# EAGLE design untitled (EAGLE 7.4.0)
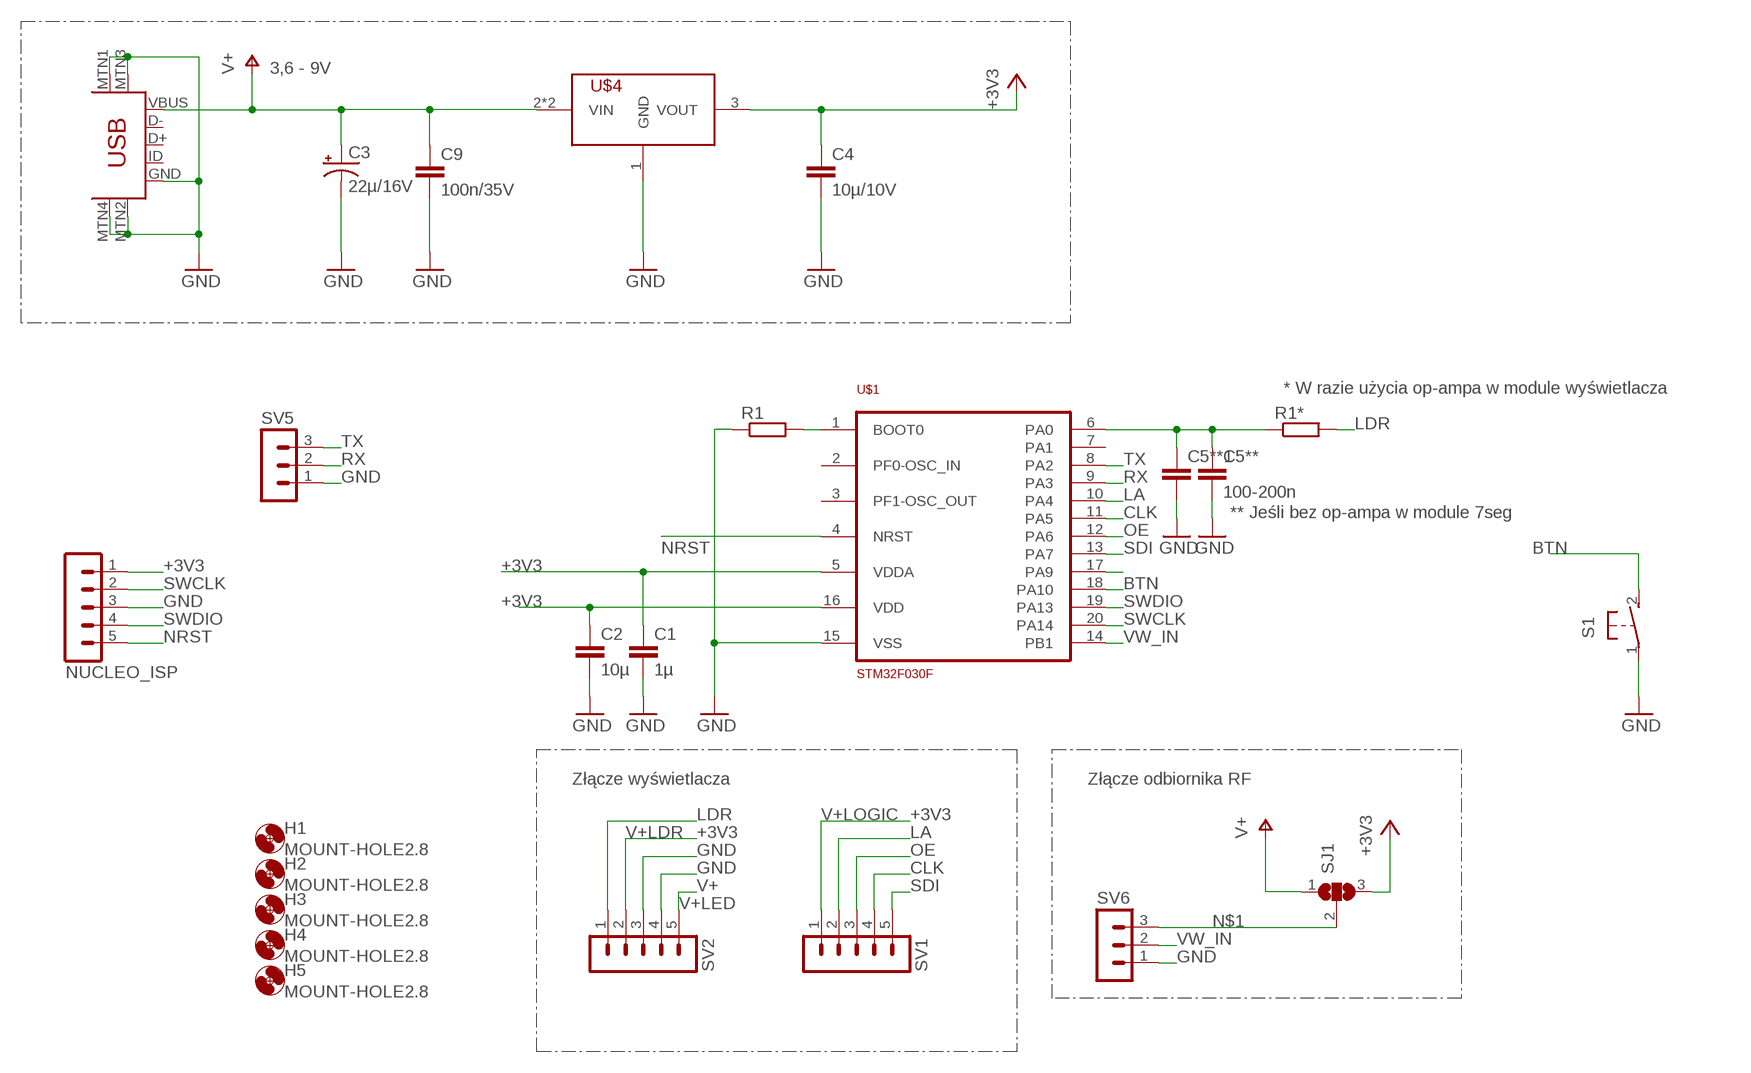
[diagram p0: schematic, sheet 1]

## Parts
C1  1µ  C-EUC0603  [C0603]
C2  10µ  C-EUC0603  [C0603]
C3  22µ/16V  CPOL-USE2.5-6  [E2,5-6]
C4  10µ/10V  C-EUC0603  [C0603]
C5**  100-200n  C-EUC0603  [C0603]
C5**1  C-EUC0603  [C0603]
C9  100n/35V  C-EUC0805  [C0805]
H1  MOUNT-HOLE2.8  [2,8]
H2  MOUNT-HOLE2.8  [2,8]
H3  MOUNT-HOLE2.8  [2,8]
H4  MOUNT-HOLE2.8  [2,8]
H5  MOUNT-HOLE2.8  [2,8]
NUCLEO_ISP  MA05-1  [MA05-1]
R1  R-EU_R0603  [R0603]
R1*  R-EU_R0603  [R0603]
S1  31-XX  [B3F-31XX]
SJ1  SJ2W  [SJ_2]
SV1  MA05-1  [MA05-1]
SV2  MA05-1  [MA05-1]
SV5  MA03-1  [MA03-1]
SV6  MA03-1  [MA03-1]
U$1  STM32F030F  [TSSOP20]
U$2  USB-MINIB-5PIN  [USB-MINIB]
U$4  HT7333  [SOT89]

## Nets
+3V3: C1.1 C2.1 C4.1 NUCLEO_ISP.1 SJ1.3 SV1.1 SV2.2 U$1.5(VDDA) U$1.16(VDD) U$4.3(VOUT)
BTN: S1.2(S) U$1.18(PA10)
CLK: SV1.4 U$1.11(PA5)
GND: C1.2 C2.2 C3.- C4.2 C5**1.2 C5**.2 C9.2 NUCLEO_ISP.3 R1.1 S1.1(P) SV2.3 SV2.4 SV5.1 SV6.1 U$1.15(VSS) U$2.GND U$2.MTN1(MTN2) U$2.MTN2(MTN3) U$2.MTN3(MTN1) U$2.MTN4 U$4.1(GND)
LA: SV1.2 U$1.10(PA4)
LDR: R1*.2 SV2.1
N$1: SJ1.2 SV6.3
N$4: C5**1.1 C5**.1 R1*.1 U$1.6(PA0)
N$6: R1.2 U$1.1(BOOT0)
N$9: U$1.17(PA9)
NRST: NUCLEO_ISP.5 U$1.4(NRST)
OE: SV1.3 U$1.12(PA6)
RX: SV5.2 U$1.9(PA3)
SDI: SV1.5 U$1.13(PA7)
SWCLK: NUCLEO_ISP.2 U$1.20(PA14)
SWDIO: NUCLEO_ISP.4 U$1.19(PA13)
TX: SV5.3 U$1.8(PA2)
V+: C3.+ C9.1 SJ1.1 SV2.5 U$2.VBUS U$4.2(VIN) U$4.2.1(VIN)
VW_IN: SV6.2 U$1.14(PB1)
Unconnected: U$1.2(PF0-OSC_IN) U$1.3(PF1-OSC_OUT) U$1.7(PA1) U$2.D+ U$2.D- U$2.ID

## Notes on the sheet
- 3,6 - 9V
- * W razie użycia op-ampa w module wyświetlacza
- ** Jeśli bez op-ampa w module 7seg
- Złącze wyświetlacza | Złącze odbiornika RF
- V+LOGIC
- V+LDR
- V+LED

## Library data of the parts
C1 C2 C4 C5** C5**1 C9 = rcl:C-EU: CAPACITOR, European symbol
C3 = adafruit:CPOL-US: POLARIZED CAPACITOR, American symbol
H1-H5 = holes:MOUNT-HOLE: MOUNTING HOLE with drill center marker
NUCLEO_ISP SV1 SV2 = con-lstb:MA05-1: PIN HEADER; OC_FARNELL: unknown; OC_NEWARK: unknown
R1 R1* = rcl:R-EU_: RESISTOR, European symbol
S1 = switch-omron:31-XX: OMRON SWITCH; MPN: B3F-3100; OC_FARNELL: 959704; OC_NEWARK: 36M3582
SJ1 = jumper:SJ2W: SMD solder JUMPER
SV5 SV6 = con-lstb:MA03-1: PIN HEADER; OC_FARNELL: unknown; OC_NEWARK: unknown
U$1 = _biblioteka_1:STM32F030
U$2 = SparkFun:USB-MINIB: Mini-USB "B" connector with 5th pin broken out. Created new symbol breaking out 5th "ID" pin in mini/micro USB connector spec. See: http://en.wikipedia.org/wiki/Mini_usb#Cables. Uses same footprint as 4-pin symbol. Also added pins to connect to mounting / shield pads if required (probably not generally needed as signals aren't shielded once they leave the connector).
U$4 = _biblioteka_1:HT7333

## Board
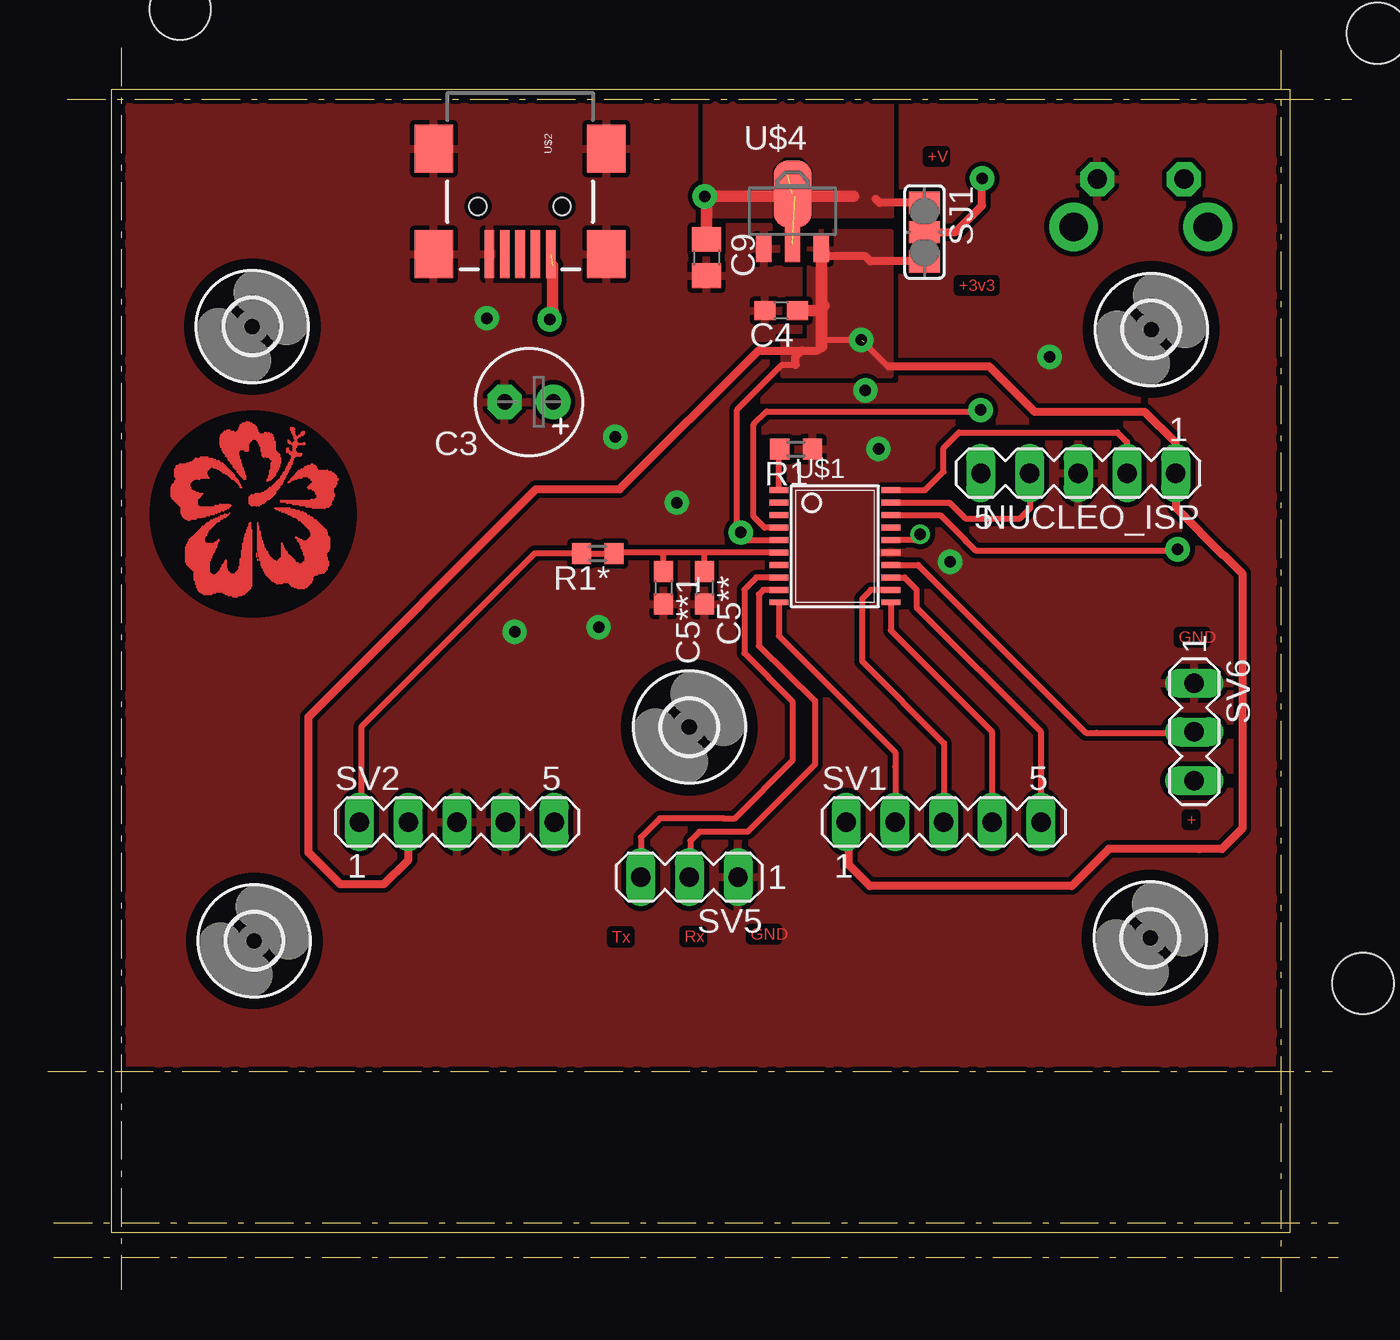
[diagram p1: board, top side]
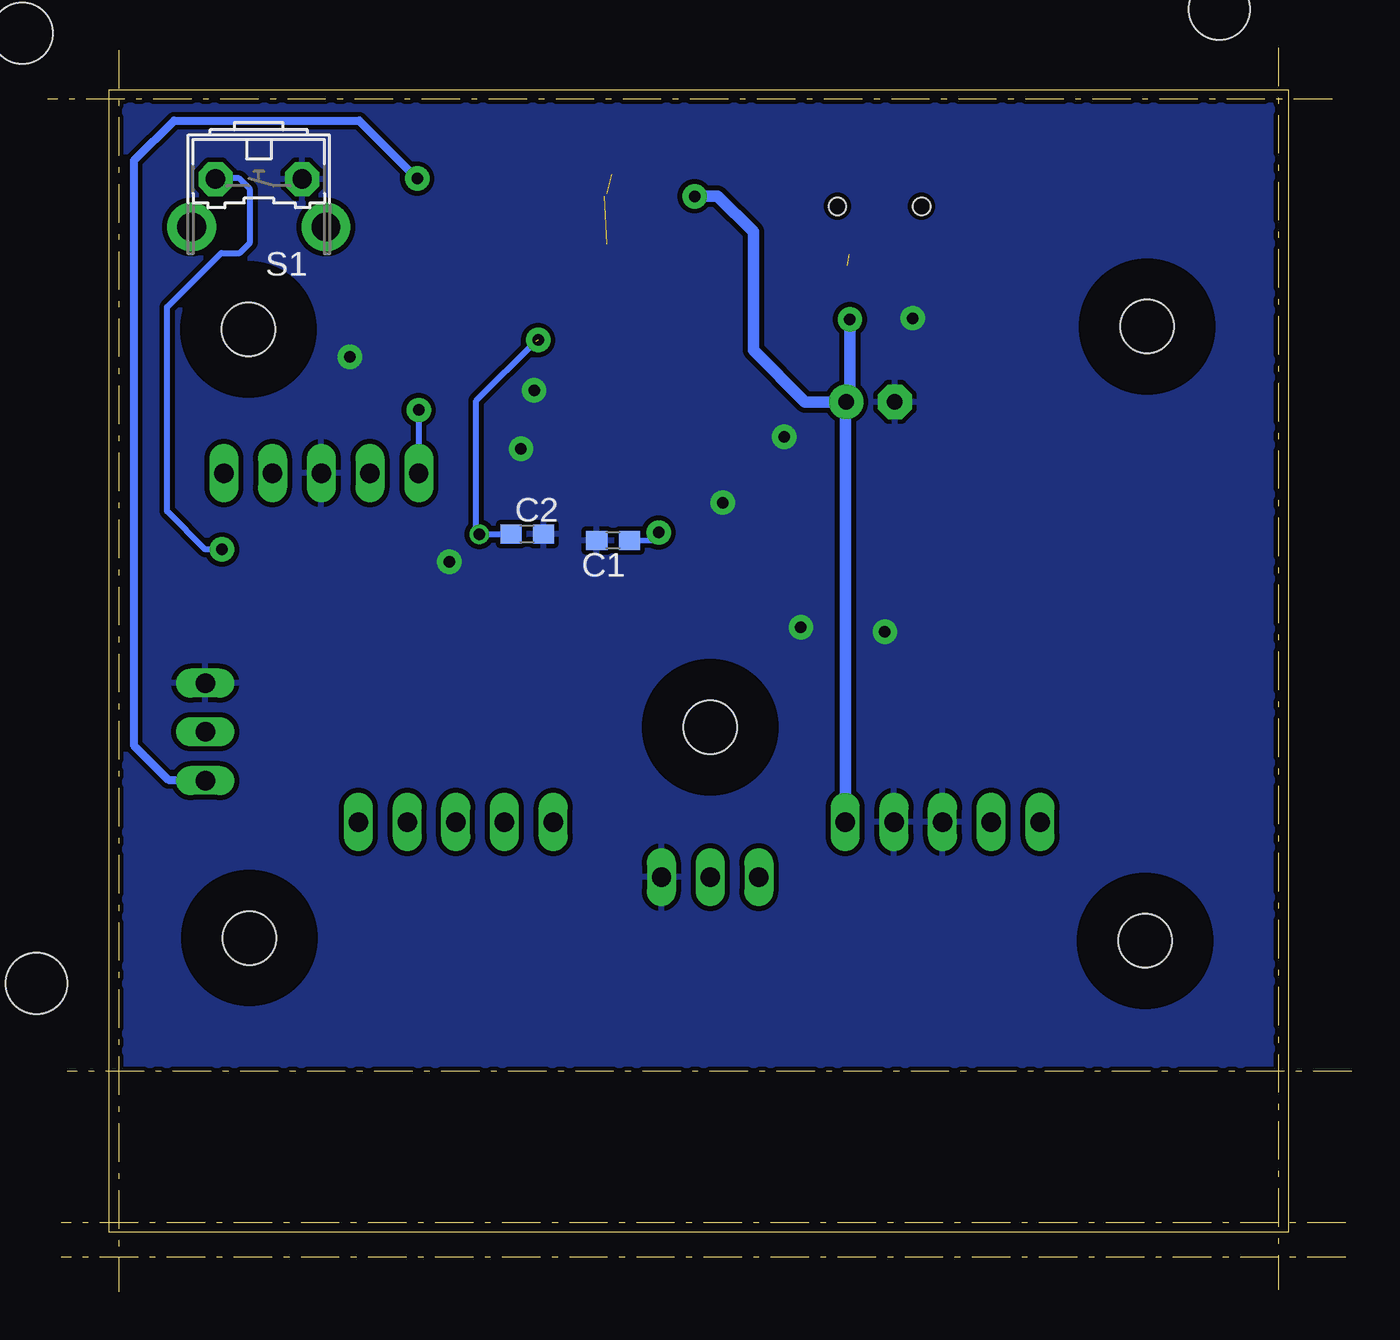
[diagram p2: board, bottom side, seen from below]

Size 68.02 x 64.91 mm. Coordinates in mm from the lower left corner, seen from the top.
Outline: 3.81,64.91 3.81,0.12
Outline: 64.31,64.79 64.31,0
Outline: 0.31,3.62 67.31,3.62
Outline: 1.02,62.22 68.02,62.22
Outline: 0.31,1.82 67.31,1.82
Outline: 0,11.52 67,11.52
Outline: 3.31,3.12 64.81,3.12 64.81,62.72 3.31,62.72 3.31,3.12
Copper layers (1*16): Top 0.035mm / dielectric 1.5mm / Bottom 0.035mm
Design rules "default *": minimum track width 10mil, minimum drill 24mil, track to track 10mil, track to pad 10mil, pad to pad 8mil, via to via 8mil, smd to smd 8mil, copper to edge 10mil, drill to drill 8mil, minimum pad ring 10mil, minimum via ring 8mil, stop-mask expansion 4mil, vias tented up to drill 0mil, thermal gap 10mil
Holes 3.2 mm at 6.9,66.94 69.38,65.68 68.61,16.09

### Footprints (pad centres in the part's own frame; a part is rotated, then mirrored left to right if it is on the bottom)
C0603 = smd 1.1 x 1: 1 -0.85,0; 2 0.85,0
E2,5-6 = drill 0.813 pad 1.778: + -1.27,0 | drill 0.813 pad 1.778 octagon: - 1.27,0
C0805 = smd 1.3 x 1.5: 1 -0.95,0; 2 0.95,0
2,8 = hole 2.8: 0,0
MA05-1 = drill 1.016 long: 1 -5.08,0; 2 -2.54,0; 3 0,0; 4 2.54,0; 5 5.08,0
R0603 = smd 1 x 1.1: 1 -0.85,0; 2 0.85,0
B3F-31XX = drill 1.016 pad 1.778 octagon: 1 -2.261,-1.245; 2 2.261,-1.245 | drill 1.499 pad 2.54: 3 -3.505,1.245; 4 3.505,1.245
SJ_2 = smd 1.168 x 1.6: 1 -1.524,0; 2 0,0; 3 1.524,0
MA03-1 = drill 1.016 long: 1 -2.54,0; 2 0,0; 3 2.54,0
TSSOP20 = smd 0.305 x 0.991: 1 -2.925,-2.918; 2 -2.275,-2.918; 3 -1.625,-2.918; 4 -0.975,-2.918; 5 -0.325,-2.918; 6 0.325,-2.918; 7 0.975,-2.918; 8 1.625,-2.918; 9 2.275,-2.918; 10 2.925,-2.918; 11 2.925,2.918; 12 2.275,2.918; 13 1.625,2.918; 14 0.975,2.918; 15 0.325,2.918; 16 -0.325,2.918; 17 -0.975,2.918; 18 -1.625,2.918; 19 -2.275,2.918; 20 -2.925,2.918
USB-MINIB = smd 2.5 x 0.5: D+ 2.5,0; D- 2.5,0.8; GND 2.5,-1.6; ID 2.5,-0.8; VBUS 2.5,1.6 | smd 2.5 x 2: MTN1 -3,4.5; MTN2 2.5,4.5; MTN3 -3,-4.5; MTN4 2.5,-4.5 | hole 0.9: 0,2.2; 0,-2.2
SOT89 = smd 0.8 x 1.4: 1 -1.499,-1.981; 3 1.499,-1.981 | smd 0.8 x 1.9: 2 0,-1.727 | smd 2 x 3.5: 2.1 0,0.889

### Placement (x,y rotation side)
C1  38.53,39.21 180 bottom
C2  43.01,39.54 0 bottom
C3  25.1,46.44 180 top
C4  38.25,51.2 180 top
C5**  34.25,36.73 270 top
C5**1  32.12,36.74 270 top
C9  34.36,53.97 270 top
DRILEGEND  [DRILEGEND]  -0.77,-3.81 0 top  (outside the outline)
H1  10.66,50.37 0 top
H2  57.56,50.22 0 top
H3  10.76,18.32 0 top
H4  57.51,18.47 0 top
H5  33.46,29.47 0 top
NUCLEO_ISP  53.76,42.72 180 top
R1  39.03,43.97 180 top
R1*  28.69,38.52 180 top
S1  57.02,56.82 180 bottom
SJ1  45.74,55.3 270 top
SV1  46.74,24.52 0 top
SV2  21.34,24.52 0 top
SV5  33.46,21.65 180 top
SV6  59.81,29.22 270 top
U$1  41.06,38.9 270 top
U$2  24.63,56.64 270 top
U$3  [LOGO_SMALL]  5.63,35.63 90 bottom
U$4  38.85,56.4 0 top

### Tracks (layer width: path | path; a pad name or v marks a point on that pad's centre or on a via)
+3V3  (via drill 0.6 pad 1.02, 0.6 pad 1.27)  (1 unrouted)
  Top 0.305: 35.95,39.82 v36.15,39.62 36.55,39.23 U$1.5 | 35.95,39.82 35.9,39.88 | v45.51,39.53 45.26,39.23 U$1.16 | 35.95,39.82 35.95,46.03 38.31,48.38 39.02,48.38 | 39.02,48.38 | 43.86,48.28 43.83,48.28 v42.44,49.67 40.39,49.67 40.35,49.71
  Top 0.406: 18.81,24.51 18.81,22.55 17.54,21.28 15.25,21.28 13.6,22.93 13.6,30.01 25.47,41.88 29.83,41.88 37.08,49.12 39.32,49.12 | SV1.1 41.79,24.39 41.79,22.27 42.88,21.18 53.41,21.18 55.35,23.11 60.07,23.11 61.25,23.11 62.33,24.19 62.33,37.47 61.37,38.43 61.34,38.43 58.84,40.92 NUCLEO_ISP.1 58.84,44.3 57.23,45.91 51.49,45.91 49.12,48.28 43.86,48.28 | 39.32,49.12 40.16,49.12 40.35,49.32 | SJ1.3 42.91,53.77 42.65,54.03 40.74,54.03 U$4.3 | 39.02,48.38 39.02,48.82 39.32,49.12
  Top 0.61: 18.81,24.51 SV2.2 | U$4.3 40.35,51.32 | 40.35,51.32 40.35,51.2 | 40.35,51.2 40.35,49.71 40.35,49.32 | C4.1 40.35,51.2 | 40.48,51.45 40.35,51.32
  Bottom 0.305: C1.1 36.55,39.23 v36.15,39.62 | 45.72,39.74 45.68,39.7 | 45.68,39.7 v45.52,39.53 | v45.52,39.53 v45.51,39.53 | 45.68,39.7 45.68,46.5 42.59,49.59 | v45.52,39.53 C2.1
  pour Top: 44.01,55.32 39.71,55.32 39.71,49.62 38.31,49.62 38.31,47.82 44.01,47.82
BTN  (via drill 0.6 pad 1.27)
  Top 0.305: U$1.18 46.56,40.53 47.89,39.2 47.89,39.18 48.38,38.69 58.89,38.69 v58.94,38.74
  Bottom 0.305: v58.94,38.74 59.8,38.74 61.8,40.74 61.8,51.38 58.98,54.21 58.01,54.21 57.48,54.75 57.48,57.53 58.05,58.1 59.24,58.1 S1.2
CLK
  Top 0.305: U$1.11 43.98,34.51 49.28,29.21 SV1.4
GND  (via drill 0.6 pad 1.27)
  other vias: 47.08,38.09 22.9,50.81 42.65,47.03 24.35,34.44 28.73,34.69 29.61,44.62 43.33,43.98 52.27,48.78 32.8,41.18
  pour Top (rank 2): 3.31,62.72 64.81,62.72 64.81,3.12 3.31,3.12
  pour Bottom: 3.31,62.32 64.81,62.32 64.81,3.12 3.31,3.12
LA
  Top 0.305: SV1.2 44.21,24.53 44.21,27.4 44.21,28.16 38.14,34.23 U$1.10
LDR
  Top 0.305: 16.23,24.54 SV2.1 16.34,24.6 16.34,29.47 25.42,38.55 27.81,38.55 R1*.2
N$1  (via drill 0.6 pad 1.27)
  Top 0.406: SJ1.2 47.35,55.3 48.74,56.68 48.74,58.09 v48.75,58.09
  Bottom 0.406: 58.6,26.71 61.74,26.71 63.54,28.51 63.54,59.03 61.44,61.12 51.77,61.12 v48.75,58.09
  Bottom 0.61: 58.6,26.71 SV6.3
N$3
  Top 0.61: 45.86,55.39 45.77,55.39 45.77,53.73
N$4
  Top 0.305: U$1.6 34.23,38.58 | 34.23,38.58 31.97,38.58 | 31.97,38.58 29.59,38.58 R1*.1 | C5**1.1 32.12,38.43 31.97,38.58 | C5**.1 34.25,38.55 34.23,38.58
N$5
  Top 0.305: 27.81,38.52 29.45,38.52 29.45,38.45
N$6
  Top 0.305: U$1.1 38.14,43.92 R1.2
NRST  (via drill 0.6 pad 1.27)
  Top 0.305: U$1.4 37.39,39.88 36.82,40.45 36.82,45.27 37.49,45.94 48.63,45.94 v48.67,46.01
  Bottom 0.305: v48.67,46.01 48.69,42.73 NUCLEO_ISP.5
OE
  Top 0.305: U$1.12 42.94,36.63 42.48,36.16 42.48,32.91 46.76,28.63 46.76,24.54 SV1.3
RX
  Top 0.305: U$1.9 37.33,36.63 37.1,36.39 37.1,33.71 40.03,30.83 40.03,27.52 36.51,24 33.99,24 33.52,23.53 33.52,21.7 SV5.2
SDI
  Top 0.305: U$1.13 44.69,37.28 45.32,36.65 45.32,35.71 51.8,29.24 51.8,24.54 SV1.5
SWCLK
  Top 0.305: U$1.20 45.76,41.83 46.73,42.8 46.73,44.03 47.54,44.85 55.8,44.85 56.3,44.34 NUCLEO_ISP.2
SWDIO
  Top 0.305: U$1.19 47.04,41.18 47.86,40.35 50.72,40.35 51.26,40.89 51.26,42.68 NUCLEO_ISP.4
TX
  Top 0.305: U$1.8 36.97,37.28 36.33,36.65 36.33,33.33 38.84,30.82 38.84,27.72 35.81,24.68 35.27,24.68 35.25,24.71 31.93,24.71 30.94,23.72 30.94,21.66 SV5.3
V+  (via drill 0.6 pad 1.27)  (3 unrouted)
  Top 0.406: SJ1.1 43.39,56.82 43.18,57.03
  Top 0.61: v26.17,50.74 26.36,51.16 26.32,51.16 26.32,53.54 | 39.35,57.25 U$4.2.1 38.98,57.17 42.03,57.17 | 38.6,58.31 38.72,58.44 | 39.35,57.25 39.27,57.17 v34.28,57.17 34.36,57.09 C9.1 | 39.58,57.47 39.35,57.25
  Bottom 0.61: v26.17,50.74 26.17,46.63 C3.+ | C3.+ 28.51,46.44 31.22,49.14 31.22,55.31 33.08,57.18 34.27,57.18 v34.28,57.17 | SV2.5 26.42,46.39 C3.+
  pour Top (no thermals): 34.31,62.72 44.01,62.72 44.01,56.12 34.31,56.12
VW_IN
  Top 0.305: SV6.2 59.74,29.15 54.74,29.15 54.72,29.17 54.16,29.17 45.4,37.93 U$1.14

### Text on the board
Top: +V | +3v3 | GND | + | Tx | Rx | GND
Document: linia lutowania złącza | krawędź PCB | Krawędź polygonu masy odsunięta od krawędzi PCB | panel przedni | otwory na śruby mocujące - 3mm / lub 2.5mm przy zachowaniu precyzji | Otwór środkowy - 7.5mm
DrillLegend: LAYER-STACK
DrillLegend_01-16: 01-16
DrillLegend_01-20: 01-20